# Altium schematic sheet Top.SchDoc
size A4
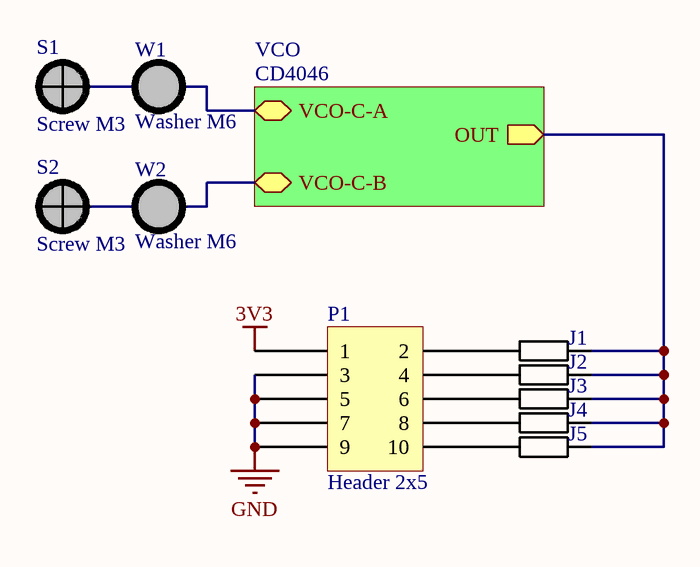
[diagram p0: Top.SchDoc]

## Parts
J1  (no value)  [R 0805 / 2012 wide]
J2  (no value)  [R 0805 / 2012 wide]
J3  (no value)  [R 0805 / 2012 wide]
J4  (no value)  [R 0805 / 2012 wide]
J5  (no value)  [R 0805 / 2012 wide]
P1  Header 2x5  [Header 2x5 IDC-10S]
S1  Screw M3  [Screw M3]
S2  Screw M3  [Screw M3]
W1  Washer M6  [Washer M6]
W2  Washer M6  [Washer M6]

## Sub-sheets
CD4046 = VCO: VCO-C-A (bidir), VCO-C-B (bidir), OUT (out)

## Nets
3V3: P1.1
GND: P1.3 P1.5 P1.7 P1.9
NetJ1_1: J1.1 P1.2
NetJ1_2: J1.2 J2.2 J3.2 J4.2 J5.2 ; sheet CD4046/OUT
NetJ2_1: J2.1 P1.4
NetJ3_1: J3.1 P1.6
NetJ4_1: J4.1 P1.8
NetJ5_1: J5.1 P1.10

## Library data of the parts
J1-J5 = Resistor